# EAGLE design SUPPLY (EAGLE 7.2.0)
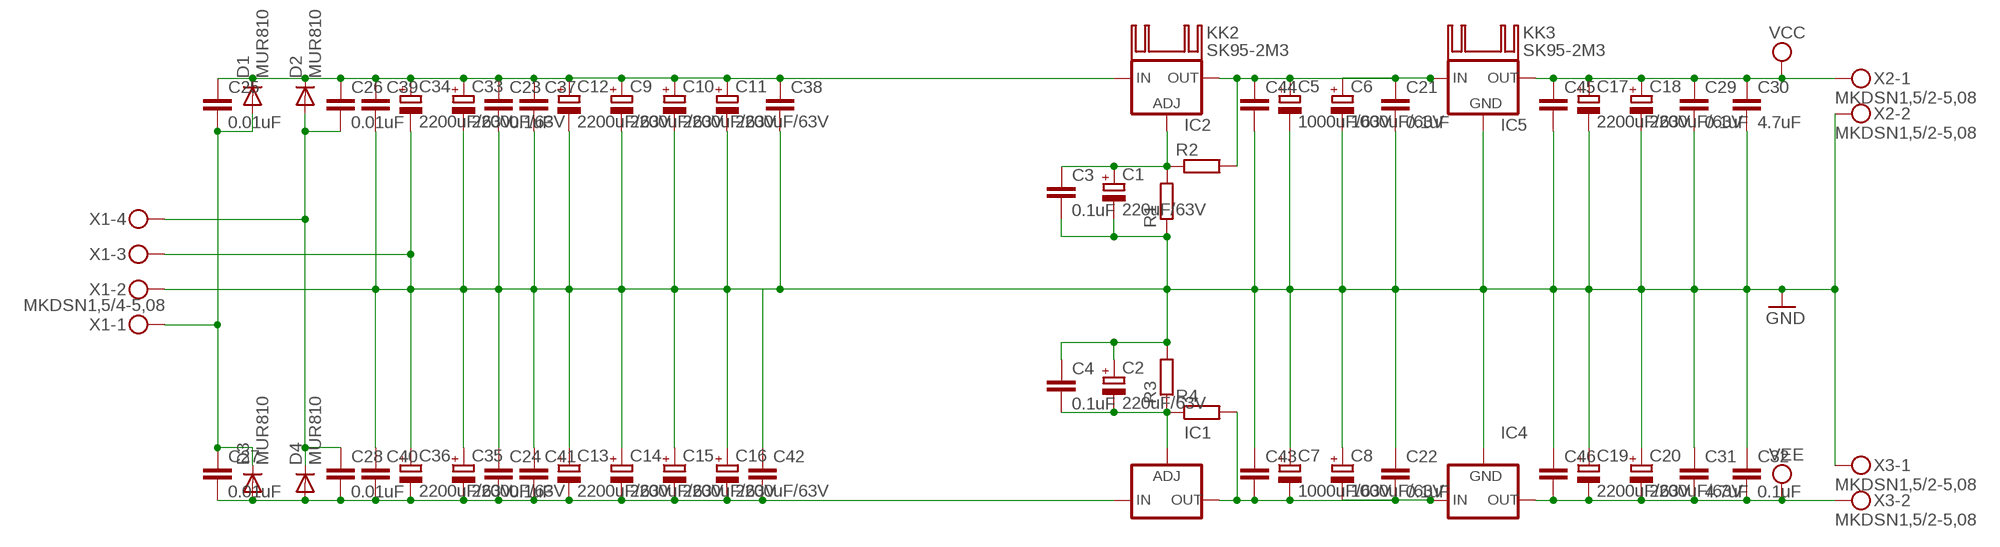
[diagram p0: schematic, sheet 1]

## Parts
C1  220uF/63V  CPOL-EUE5-10.5  [E5-10,5]
C2  220uF/63V  CPOL-EUE5-10.5  [E5-10,5]
C3  0.1uF  C-EU050-035X075  [C050-035X075]
C4  0.1uF  C-EU050-035X075  [C050-035X075]
C5  1000uF/63V  CPOL-EUE7.5-16  [E7,5-16]
C6  1000uF/63V  CPOL-EUE7.5-16  [E7,5-16]
C7  1000uF/63V  CPOL-EUE7.5-16  [E7,5-16]
C8  1000uF/63V  CPOL-EUE7.5-16  [E7,5-16]
C9  2200uF/63V  CPOL-EUE7.5-18  [E7,5-18]
C10  2200uF/63V  CPOL-EUE7.5-18  [E7,5-18]
C11  2200uF/63V  CPOL-EUE7.5-18  [E7,5-18]
C12  2200uF/63V  CPOL-EUE7.5-18  [E7,5-18]
C13  2200uF/63V  CPOL-EUE7.5-18  [E7,5-18]
C14  2200uF/63V  CPOL-EUE7.5-18  [E7,5-18]
C15  2200uF/63V  CPOL-EUE7.5-18  [E7,5-18]
C16  2200uF/63V  CPOL-EUE7.5-18  [E7,5-18]
C17  2200uF/63V  CPOL-EUE7.5-18  [E7,5-18]
C18  2200uF/63V  CPOL-EUE7.5-18  [E7,5-18]
C19  2200uF/63V  CPOL-EUE7.5-18  [E7,5-18]
C20  2200uF/63V  CPOL-EUE7.5-18  [E7,5-18]
C21  0.1uF  C-EU050-035X075  [C050-035X075]
C22  0.1uF  C-EU050-035X075  [C050-035X075]
C23  0.1uF  C-EU050-035X075  [C050-035X075]
C24  0.1uF  C-EU050-035X075  [C050-035X075]
C25  0.01uF  C-EU050-035X075  [C050-035X075]
C26  0.01uF  C-EU050-035X075  [C050-035X075]
C27  0.01uF  C-EU050-035X075  [C050-035X075]
C28  0.01uF  C-EU050-035X075  [C050-035X075]
C29  0.1uF  C-EU102-054X133  [C102-054X133]
C30  4.7uF  C-EU102-054X133  [C102-054X133]
C31  4.7uF  C-EU102-054X133  [C102-054X133]
C32  0.1uF  C-EU102-054X133  [C102-054X133]
C33  2200uF/63V  CPOL-EUE7.5-18  [E7,5-18]
C34  2200uF/63V  CPOL-EUE7.5-18  [E7,5-18]
C35  2200uF/63V  CPOL-EUE7.5-18  [E7,5-18]
C36  2200uF/63V  CPOL-EUE7.5-18  [E7,5-18]
C37  C-EUC1210  [C1210]
C38  C-EUC1210  [C1210]
C39  C-EUC1210  [C1210]
C40  C-EUC1210  [C1210]
C41  C-EUC1210  [C1210]
C42  C-EUC1210  [C1210]
C43  C-EUC1210  [C1210]
C44  C-EUC1210  [C1210]
C45  C-EUC1210  [C1210]
C46  C-EUC1210  [C1210]
D1  MUR810  [TO220ACS]
D2  MUR810  [TO220ACS]
D3  MUR810  [TO220ACS]
D4  MUR810  [TO220ACS]
IC1  LM337TS  [337TS]
IC2  LM317TS  [317TS]
IC4  79XXS  [79XXS]
IC5  78XXS  [78XXS]
KK2  SK95-2M3  [SK95-2M3]
KK3  SK95-2M3  [SK95-2M3]
R1  R-EU_0207/10  [0207/10]
R2  R-EU_0207/10  [0207/10]
R3  R-EU_0207/10  [0207/10]
R4  R-EU_0207/10  [0207/10]
X1  MKDSN1,5/4-5,08  [MKDSN1,5/4-5,08]
X2  MKDSN1,5/2-5,08  [MKDSN1,5/2-5,08]
X3  MKDSN1,5/2-5,08  [MKDSN1,5/2-5,08]

## Nets
GND: C1.- C2.+ C3.2 C4.1 C5.- C6.- C7.+ C8.+ C9.- C10.- C11.- C12.- C13.+ C14.+ C15.+ C16.+ C17.- C18.- C19.+ C20.+ C21.2 C22.1 C23.2 C24.1 C29.2 C30.2 C31.1 C32.1 C33.- C34.- C35.+ C36.+ C37.2 C38.2 C39.2 C40.1 C41.1 C42.1 C43.1 C44.2 C45.2 C46.1 IC4.GND IC5.GND R1.1 R3.2 X1.2 X1.3 X2.2 X3.1
N$5: C2.- C4.2 IC1.1(ADJ) R3.1 R4.1
N$6: C1.+ C3.1 IC2.1(ADJ) R1.2 R2.1
N$13: C25.2 C27.1 D1.A D3.C X1.1
N$16: C26.2 C28.1 D2.A D4.C X1.4
VCC: C17.+ C18.+ C29.1 C30.1 C45.1 IC5.OUT X2.1
VCCIN: C9.+ C10.+ C11.+ C12.+ C23.1 C25.1 C26.1 C33.+ C34.+ C37.1 C38.1 C39.1 D1.C D2.C IC2.3(IN)
VCCP: C5.+ C6.+ C21.1 C44.1 IC2.2(OUT) IC5.IN R2.2
VEE: C19.- C20.- C31.2 C32.2 C46.2 IC4.OUT X3.2
VEEIN: C13.- C14.- C15.- C16.- C24.2 C27.2 C28.2 C35.- C36.- C40.2 C41.2 C42.2 D3.A D4.A IC1.2(IN)
VEEP: C7.- C8.- C22.2 C43.2 IC1.3(OUT) IC4.IN R4.2

## Library data of the parts
C1 C2 C5-C20 C33-C36 = Vwvwbg:CPOL-EU: POLARIZED CAPACITOR, European symbol
C3 C4 C21-C32 = Vwvwbg:C-EU: CAPACITOR, European symbol
C37-C46 = resistor:C-EU: CAPACITOR, European symbol
D1-D4 = diode:MUR810: DIODE
IC1 = v-reg:LM337TS: VOLTAGE REGULATOR
IC2 = v-reg:LM317TS: VOLTAGE REGULATOR
IC4 = v-reg:79XXS: VOLTAGE REGULATOR
IC5 = v-reg:78XXS: VOLTAGE REGULATOR
KK2 KK3 = heatsink:SK95-2M3: HEATSINK manufacturer Fischer/distributor Buerklin
R1-R4 = Vwvwbg:R-EU_: RESISTOR, European symbol
X1 = con-phoenix-508:MKDSN1,5/4-5,08: MKDSN 1,5/ 4-5,08 Printklemme Nennstrom: 13,5 A Nennspannung: 250 V Rastermaß: 5,08 mm Polzahl: 4 Anschlussart: Schraubanschluss Montage: Löten Anschlussrichtung Leiter/Platine: 0 ° Artikelnummer: 1729144 Source: http://eshop.phoenixcontact.com .. 1729144.pdf
X2 X3 = con-phoenix-508:MKDSN1,5/2-5,08: MKDSN 1,5/ 2-5,08 Printklemme Nennstrom: 13,5 A Nennspannung: 250 V Rastermaß: 5,08 mm Polzahl: 2 Anschlussart: Schraubanschluss Montage: Löten Anschlussrichtung Leiter/Platine: 0 ° Artikelnummer: 1729128 Source: http://eshop.phoenixcontact.com .. 1729128.pdf

## Board
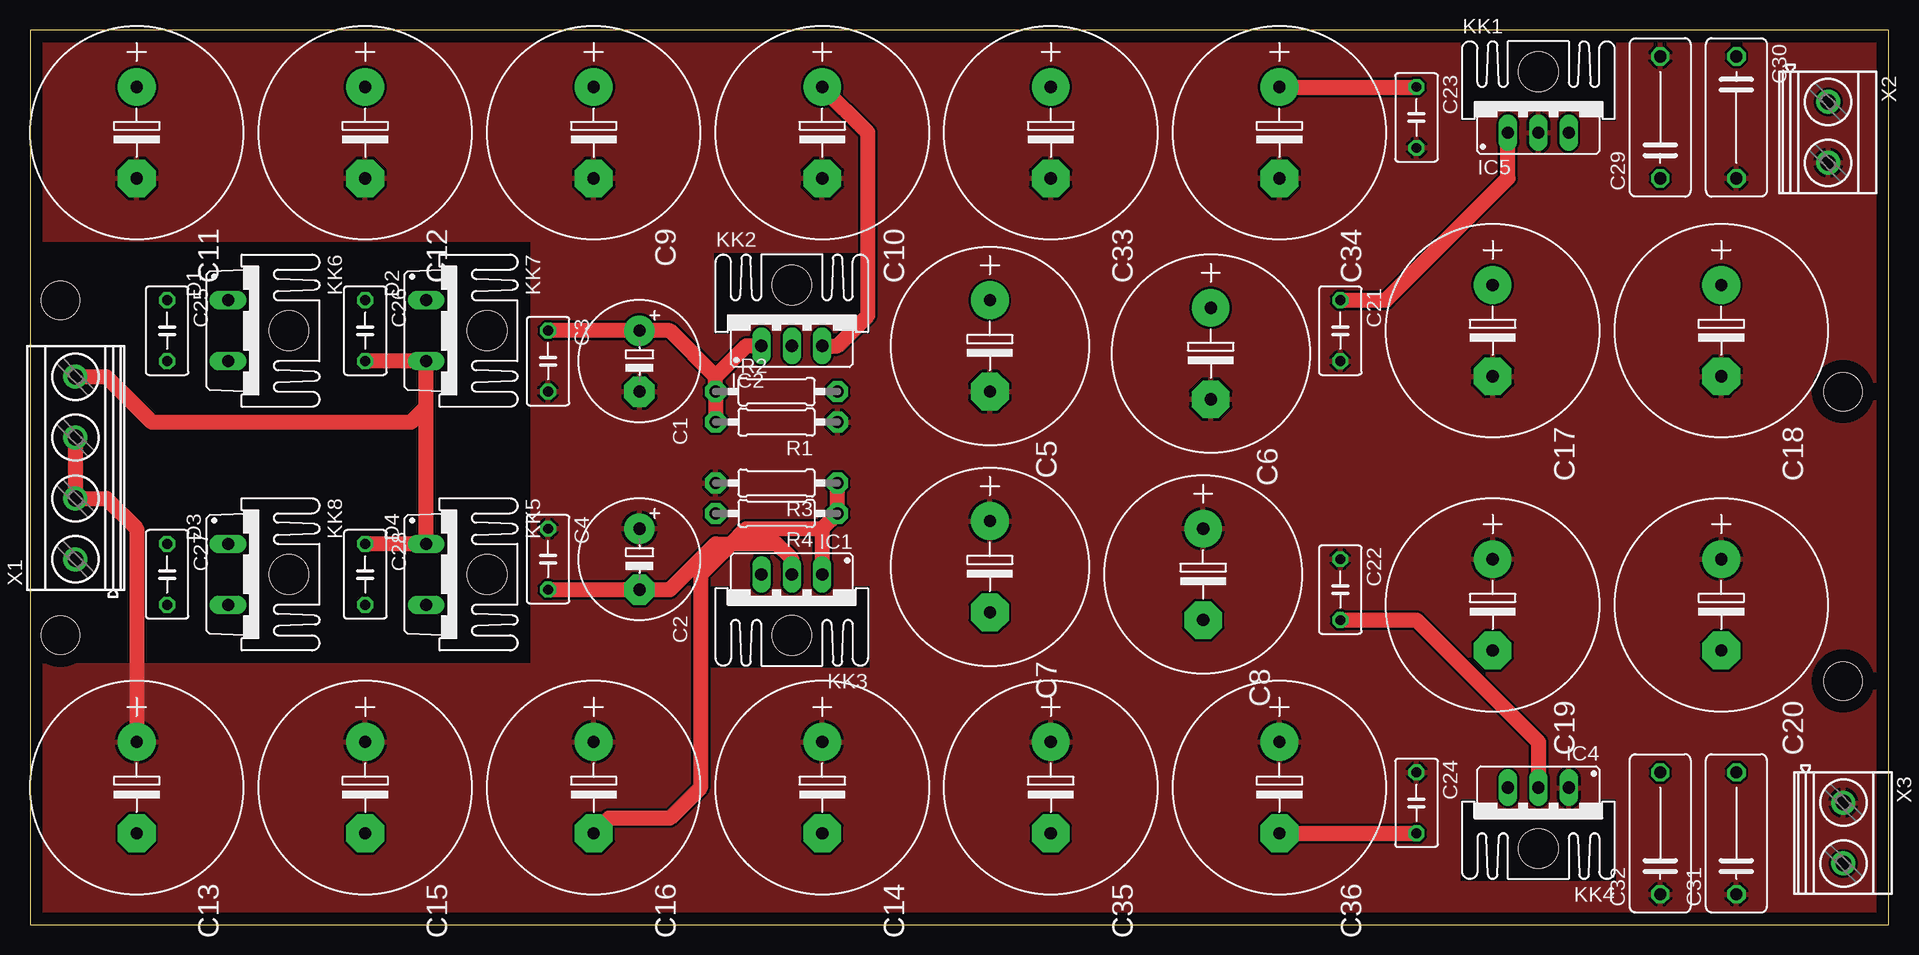
[diagram p1: board, top side]
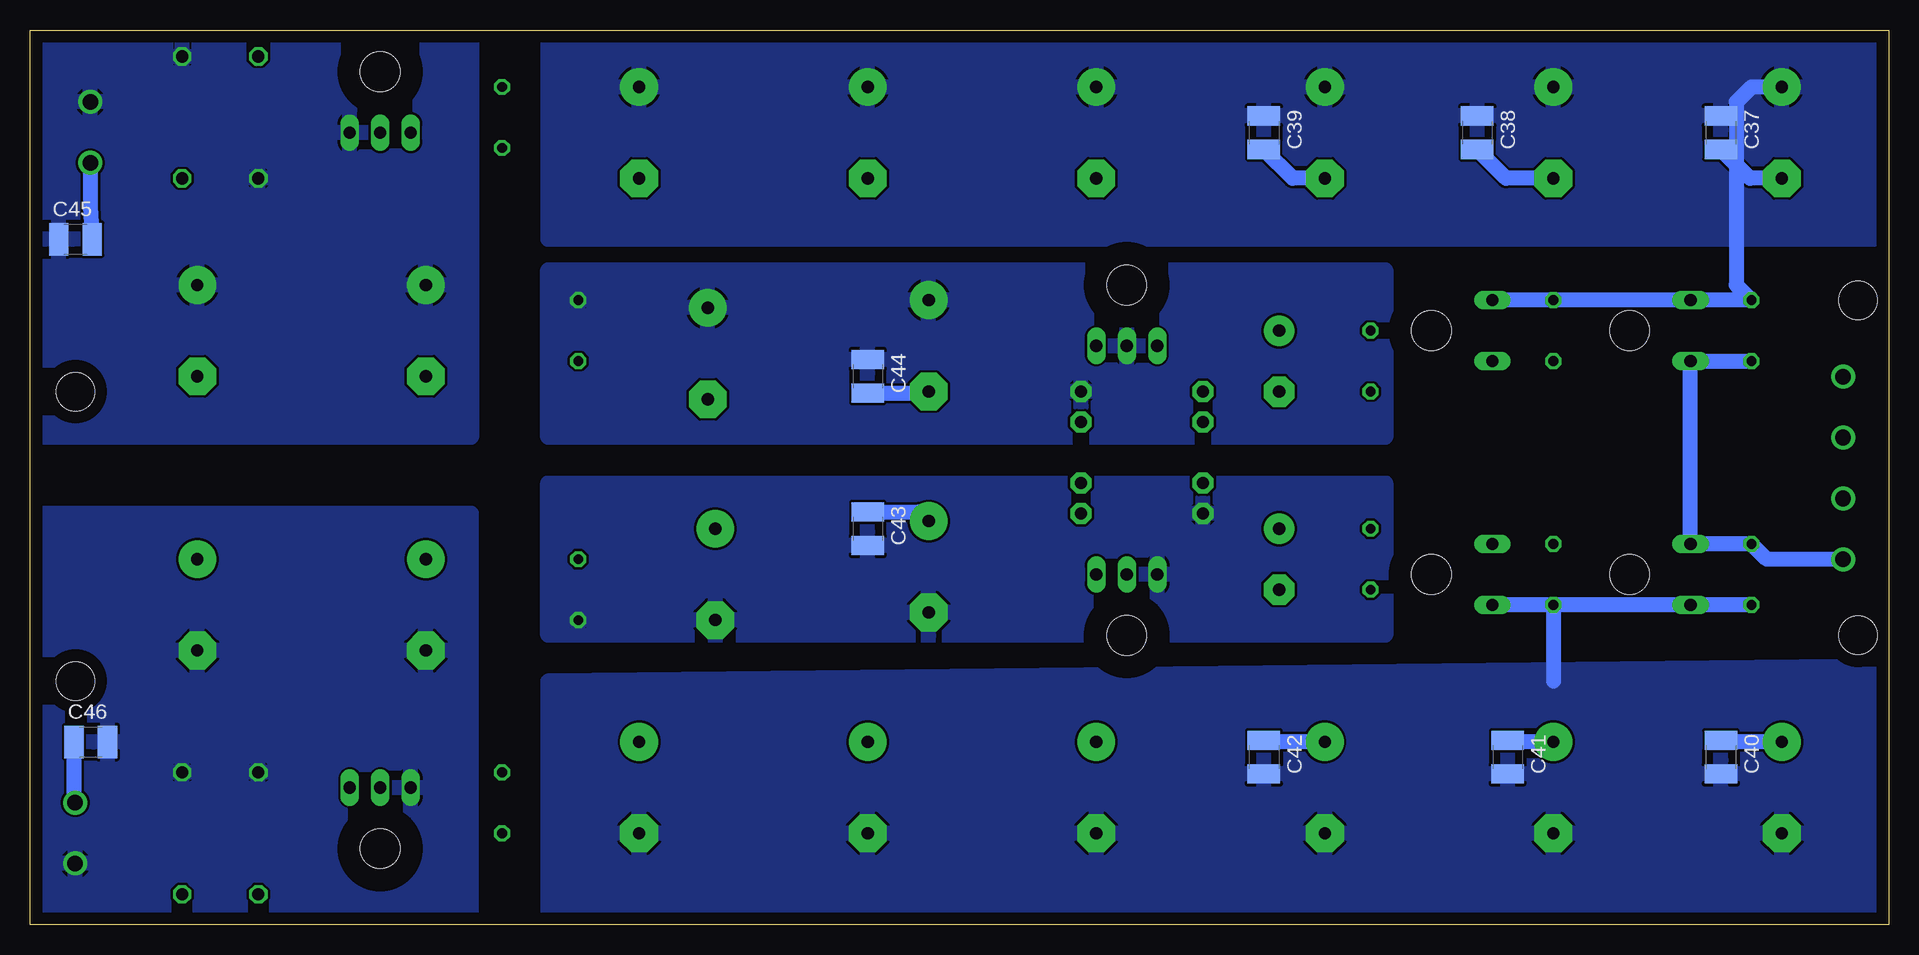
[diagram p2: board, bottom side, seen from below]

Size 154.92 x 74.6 mm. Coordinates in mm from the lower left corner, seen from the top.
Outline: 0,0 154.92,0 154.92,74.6 0,74.6 0,0
Copper layers (1*16): Top 0.035mm / dielectric 1.5mm / Bottom 0.035mm
Design rules "default": minimum track width 10mil, minimum drill 24mil, track to track 8mil, track to pad 8mil, pad to pad 8mil, via to via 8mil, smd to smd 8mil, copper to edge 40mil, drill to drill 8mil, minimum pad ring 10mil, minimum via ring 8mil, stop-mask expansion 4mil, vias tented up to drill 0mil, thermal gap 10mil
Holes 3.2 mm at 2.54,52.07 2.54,24.13 151.13,20.32 151.13,44.45

### Footprints (pad centres in the part's own frame; a part is rotated, then mirrored left to right if it is on the bottom)
E5-10,5 = drill 1.016 pad 2.54: + -2.54,0 | drill 1.016 pad 2.54 octagon: - 2.54,0
C050-035X075 = drill 0.813 octagon: 1 -2.54,0; 2 2.54,0
E7,5-16 = drill 1.016 pad 3.15: + -3.81,0 | drill 1.016 pad 3.15 octagon: - 3.81,0
E7,5-18 = drill 1.016 pad 3.15: + -3.81,0 | drill 1.016 pad 3.15 octagon: - 3.81,0
C102-054X133 = drill 1.016 octagon: 1 -5.08,0; 2 5.08,0
C1210 = smd 1.6 x 2.7: 1 -1.4,0; 2 1.4,0
TO220ACS = drill 1.016 long: A 2.54,-2.54; C -2.54,-2.54
337TS = drill 1.016 long: 1 -2.54,-2.54; 2 0,-2.54; 3 2.54,-2.54
317TS = drill 1.016 long: 1 -2.54,-2.54; 2 0,-2.54; 3 2.54,-2.54
79XXS = drill 1.016 long: GND -2.54,-2.54; IN 0,-2.54; OUT 2.54,-2.54
78XXS = drill 1.016 long: GND 0,-2.54; IN -2.54,-2.54; OUT 2.54,-2.54
SK95-2M3 = hole 3.302: 0,2.54
0207/10 = drill 1 pad 1.778 octagon: 1 -5.08,0; 2 5.08,0
MKDSN1,5/4-5,08 = drill 1.3 pad 2: 1 -7.641,0.025; 2 -2.561,0.025; 3 2.519,0.025; 4 7.599,0.025
MKDSN1,5/2-5,08 = drill 1.3 pad 2: 1 -2.561,0.025; 2 2.519,0.025

### Placement (x,y rotation side)
C1  50.8,46.99 270 top
C2  50.8,30.48 270 top
C3  43.18,46.99 270 top
C4  43.18,30.48 270 top
C5  80.01,48.26 270 top
C6  98.42,47.63 270 top
C7  80.01,29.84 270 top
C8  97.79,29.21 270 top
C9  46.99,66.04 270 top
C10  66.04,66.04 270 top
C11  8.89,66.04 270 top
C12  27.94,66.04 270 top
C13  8.89,11.43 270 top
C14  66.04,11.43 270 top
C15  27.94,11.43 270 top
C16  46.99,11.43 270 top
C17  121.92,49.53 270 top
C18  140.97,49.53 270 top
C19  121.92,26.67 270 top
C20  140.97,26.67 270 top
C21  109.22,49.53 270 top
C22  109.22,27.94 270 top
C23  115.57,67.31 270 top
C24  115.57,10.16 270 top
C25  11.43,49.53 270 top
C26  27.94,49.53 270 top
C27  11.43,29.21 270 top
C28  27.94,29.21 270 top
C29  135.89,67.31 90 top
C30  142.24,67.31 270 top
C31  142.24,7.62 90 top
C32  135.89,7.62 90 top
C33  85.09,66.04 270 top
C34  104.14,66.04 270 top
C35  85.09,11.43 270 top
C36  104.14,11.43 270 top
C37  13.97,66.04 270 bottom
C38  34.29,66.04 270 bottom
C39  52.07,66.04 270 bottom
C40  13.97,13.97 270 bottom
C41  31.75,13.97 270 bottom
C42  52.07,13.97 270 bottom
C43  85.09,33.02 270 bottom
C44  85.09,45.72 270 bottom
C45  151.13,57.15 0 bottom
C46  149.86,15.24 0 bottom
D1  19.05,49.53 270 top
D2  35.56,49.53 270 top
D3  19.05,29.21 270 top
D4  35.56,29.21 270 top
IC1  63.5,26.67 180 top
IC2  63.5,50.8 0 top
IC4  125.73,8.89 180 top
IC5  125.73,68.58 0 top
KK1  SK95-2M3  [SK95-2M3]  125.73,68.58 0 top
KK2  63.5,50.8 0 top
KK3  63.5,26.67 180 top
KK4  SK95-2M3  [SK95-2M3]  125.73,8.89 180 top
KK5  SK95-2M3  [SK95-2M3]  35.56,29.21 270 top
KK6  SK95-2M3  [SK95-2M3]  19.05,49.53 270 top
KK7  SK95-2M3  [SK95-2M3]  35.56,49.53 270 top
KK8  SK95-2M3  [SK95-2M3]  19.05,29.21 270 top
R1  62.23,41.91 180 top
R2  62.23,44.45 0 top
R3  62.23,36.83 180 top
R4  62.23,34.29 180 top
X1  3.81,38.1 90 top
X2  149.86,66.04 270 top
X3  151.13,7.62 270 top

### Tracks (layer width: path | path; a pad name or v marks a point on that pad's centre or on a via)
GND
  Top 1.27: X1.3 X1.2 6.37,35.54 8.89,33.02 C13.+
  Bottom 1.27: C44.2 80.14,44.32 C5.- | C43.1 80.78,34.42 C7.+ | C15.+ 31.75,15.24 C41.1 | C16.+ 52.07,15.24 C42.1 | C13.+ 13.84,15.24 C40.1 | C11.- 11.56,62.23 C37.2 | C12.- 31.88,62.23 C38.2 | C9.- 49.66,62.23 C39.2 | X2.2 149.88,59.85 C45.2 | C46.1 151.26,10.29 X3.1
  pour Top: 0,57.15 41.91,57.15 41.91,21.59 0,21.59 0,0 161.29,-1.27 161.29,72.39 160.02,74.93 0,74.93
N$5
  Top 1.27: C4.2 C2.- 53.34,27.94 57.15,31.75 58.42,31.75 59.69,33.02 66.04,33.02 | 66.04,33.02 R4.1 R3.1 | 66.04,33.02 IC1.1
N$6
  Top 1.27: IC2.1 59.69,48.26 57.15,45.72 | R1.2 R2.1 57.15,45.72 | 57.15,45.72 53.34,49.53 C1.+ C3.1
N$13
  Bottom 1.27: X1.1 10.14,30.46 C27.1 D3.C D1.A C25.2
N$16
  Top 1.27: X1.4 6.37,45.7 10.16,41.91 31.75,41.91 33.02,43.18 D2.A | D2.A C26.2 | D2.A D4.C C28.1
VCC
  pour Bottom: 118.11,74.93 118.11,40.64 160.02,40.64 160.02,74.93
VCCIN
  Top 1.27: IC2.3 67.31,48.26 69.85,50.8 69.85,66.04 C10.+ | C34.+ C23.1
  Bottom 1.27: C11.+ 11.43,69.85 12.7,68.58 12.7,53.34 C25.1 D1.C C26.1 D2.C
  pour Bottom: 111.76,57.15 1.27,57.15 1.27,73.66 111.76,73.66 111.76,58.42
VCCP
  Top 1.27: C21.1 113.03,52.07 123.19,62.23 IC5.IN
  pour Bottom: 41.91,40.64 111.76,40.64 111.76,54.61 41.91,54.61 41.91,41.91
VEE
  pour Bottom: 118.11,34.29 160.02,34.29 160.02,0 118.11,0
VEEIN
  Top 1.27: IC1.2 63.5,30.48 62.23,31.75 58.42,31.75 55.88,29.21 55.88,11.43 53.34,8.89 48.26,8.89 C16.- | C36.- C24.2
  Bottom 1.27: C27.2 D3.A C28.2 | C28.2 D4.A | C28.2 27.94,20.32
  pour Bottom: 111.76,20.32 111.76,0 0,0 0,21.59
VEEP
  Top 1.27: C22.2 115.57,25.4 125.73,15.24 IC4.IN
  pour Bottom: 111.76,35.56 111.76,36.83 41.91,36.83 41.91,24.13 111.76,24.13